# EasyEDA Pro project ProProject_5加1个按键模块-开源_2023-12-06.epro

# Schematic schematic2
Create Date: 2022-10-30; Page Name: P1; Project Name: 5个按键B; Schematic Name: Schematic2; Company: 嘉立创EDA; Page Size: A4; Version: V1.0
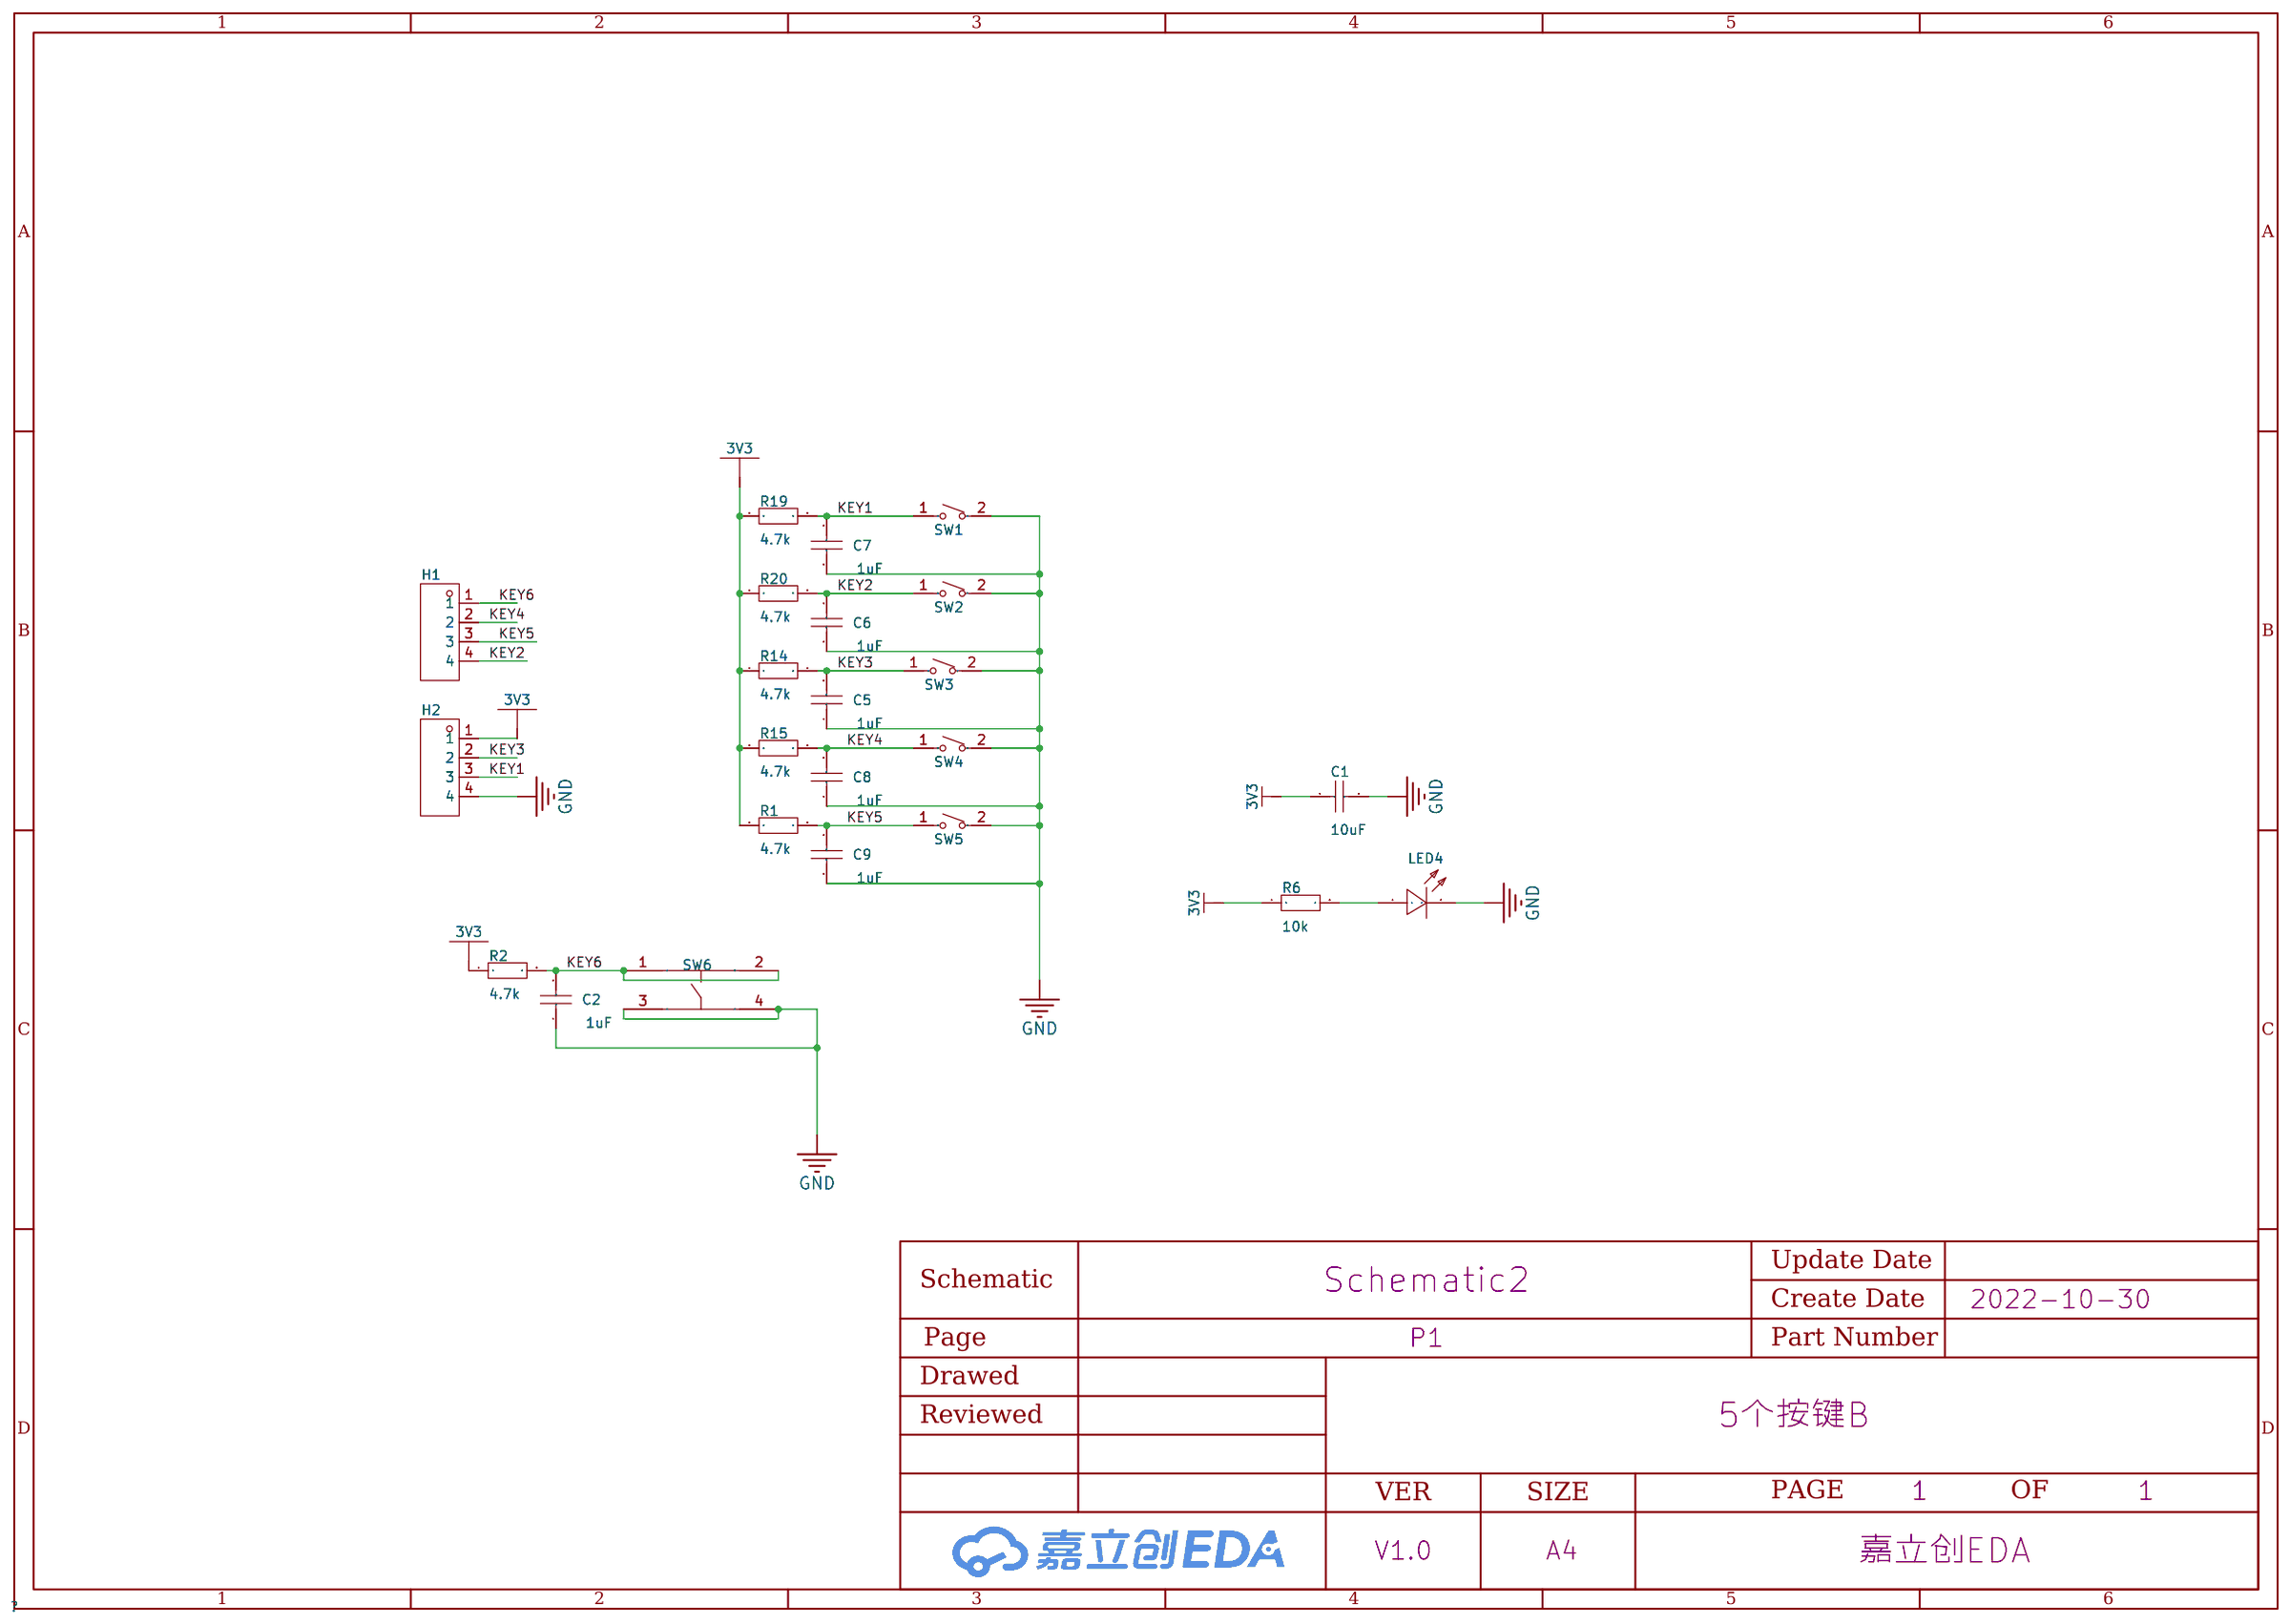
[diagram p0: schematic sheet]

## Parts
C1  10uF  [C0805]
C2  1uF  [C0603]
C5  1uF  [C0603]
C6  1uF  [C0603]
C7  1uF  [C0603]
C8  1uF  [C0603]
C9  1uF  [C0603]
H1  -  [HDR-TH_4P-P2.54-V-F]
H2  -  [HDR-TH_4P-P2.54-V-F]
LED4  KT-0603R  [LED0603-R-RD]
R1  4.7k  [R0603_3]
R2  4.7k  [R0603_3]
R6  10k  [R0603]
R14  4.7k  [R0603_3]
R15  4.7k  [R0603_3]
R19  4.7k  [R0603_3]
R20  4.7k  [R0603_3]
SW1  GT-TC141A-H050-L1  [SW-TH_L6.0-W6.0-P5.00]
SW2  GT-TC141A-H050-L1  [SW-TH_L6.0-W6.0-P5.00]
SW3  GT-TC141A-H050-L1  [SW-TH_L6.0-W6.0-P5.00]
SW4  GT-TC141A-H050-L1  [SW-TH_L6.0-W6.0-P5.00]
SW5  GT-TC141A-H050-L1  [SW-TH_L6.0-W6.0-P5.00]
SW6  PTS810SJM250SMTRLFS  [KEY-SMD_4P-L4.2-W3.2-P2.20-LS4.6]

## Library data of the parts
C1 = CL21A106KAYNNNE_C15850: 容值:10uF;精度:±10%;额定电压:25V;材质(温度系数):X5R;; LCSC Part Name: 10uF ±10% 25V; Supplier Part: C15850; Manufacturer: SAMSUNG(三星); Manufacturer Part: CL21A106KAYNNNE; Supplier Footprint: 0805; JLCPCB Part Class: 基础库; Datasheet: https://atta.szlcsc.com/upload/public/pdf/source/20160103/1457707679302.pdf; Supplier: LCSC; Tolerance: ±10%; Voltage Rated: 25V; Temperature Coefficient: X5R
C2 C5-C9 = 0603F105M160NT: 容值:1uF;精度:±20%;额定电压:16V;材质(温度系数):Y5V;; LCSC Part Name: 1uF ±20% 16V; Supplier Part: C1689; Manufacturer: FH(风华); Supplier Footprint: 0603; JLCPCB Part Class: 扩展库; Datasheet: https://atta.szlcsc.com/upload/public/pdf/source/20170923/C1689_1506149319442988473.pdf; Supplier: LCSC; Tolerance: ±20%; Voltage Rated: 16V; Temperature Coefficient: Y5V
H1 H2 = HDR-F_2.54_1x4P: Supplier Part: C2718488; Supplier Footprint: 插件
LED4 = KT-0603R: 发光颜色:红灯;二极管配置:-;透镜颜色:-;主波长:-;峰值波长:-;色温:-;光通量(25时):-;测试电流:-;正向电压(VF):-;发光强度:-;功率:-;发光角度:-;安装方式:-;工作温度:-40~+85;; LCSC Part Name: 红灯; Supplier Part: C2286; Manufacturer: KENTO; Supplier Footprint: 0603; JLCPCB Part Class: 基础库; Datasheet: https://atta.szlcsc.com/upload/public/pdf/source/20160616/1466072038404.pdf; Supplier: LCSC; Emitted Color: 红灯; Operating Temperature: -40~+85
R1 R2 R14 R15 R19 R20 = 0603WAF4701T5E: 电阻类型:厚膜电阻;阻值:4.7k;精度:±1%;功率:1/10W;温度系数:±100ppm/;最大工作电压:75V;工作温度范围:-55~+155;; LCSC Part Name: 4.7k ±1%; Supplier Part: C23162; Manufacturer: UNI-ROYAL(厚声); Supplier Footprint: 0603; Datasheet: https://atta.szlcsc.com/upload/public/pdf/source/20200306/C422600_1E6D84923E4A46A82E41ADD87F860B5C.pdf; Supplier: LCSC; Type: 厚膜电阻; Tolerance: ±1%; Power(Watts): 1/10W; Temperature Coefficient: ±100ppm/; Overload Voltage (Max): 75V; Operating Temperature Range: -55~+155; JLCPCB Part Class: Basic Part
R6 = 0603WAF1002T5E: 电阻类型:厚膜电阻;阻值:10k;精度:±1%;功率:1/10W;温度系数:±100ppm/;最大工作电压:75V;工作温度范围:-55~+155;; LCSC Part Name: 10k ±1%; Supplier Part: C25804; Manufacturer: UNI-ROYAL(厚声); Supplier Footprint: 0603; Datasheet: https://atta.szlcsc.com/upload/public/pdf/source/20200306/C422600_1E6D84923E4A46A82E41ADD87F860B5C.pdf; Supplier: LCSC; Type: 厚膜电阻; Tolerance: ±1%; Power(Watts): 1/10W; Temperature Coefficient: ±100ppm/; Overload Voltage (Max): 75V; Operating Temperature Range: -55~+155; JLCPCB Part Class: Basic Part
SW1-SW5 = GT-TC141A-H050-L1: 触点电流:50mA;额定电压(DC):12V;绝缘电阻:100MΩ;电路结构:单刀单掷;安装方式:直插;按钮形状:圆形按钮;按钮/盖帽颜色:白色;带灯:无;作用力:160gf@±30gf;机械寿命:100000;工作温度:-30℃~+85℃;引脚样式:PC引脚;开关长度:6.0mm;开关宽度:6.0mm;开关高度:5.0mm;带支架:否;; LCSC Part Name: 6x6圆形中两脚轻触开关160gf; Supplier Part: C2837071; Manufacturer: G-Switch(品赞); Supplier Footprint: 插件,6x6x5mm; JLCPCB Part Class: 扩展库; Datasheet: https://atta.szlcsc.com/upload/public/pdf/source/20210607/C2837071_E30151F7740166F304909F7305A1B181.pdf; Supplier: LCSC; Contact Current: 50mA; Voltage Rating (DC): 12V; Insulation Resistance: 100MΩ; Circuit: 单刀单掷; Mounting Style: 直插; Actuator Style: 圆形按钮; Actuator/Cap Color: 白色; With Lamp: 无; Operating Force: 160gf@±30gf; Mechanical Life: 100000; Operating Temperature: -30℃~+85℃; Pin Style: PC引脚; Switch Length: 6.0mm; Switch Width: 6.0mm; Switch Height: 5.0mm; Strike Gundam: 否
SW6 = PTS810SJM250SMTRLFS: 触点电流:50mA;额定电压(DC):16V;电路结构:单刀单掷;安装方式:立贴;按钮形状:圆形按钮;带灯:-;开关长度:4.2mm;开关宽度:3.2mm;开关高度:2.5mm;; Supplier Part: C116501; Manufacturer: C&K; Supplier Footprint: SMD; JLCPCB Part Class: 扩展库; Datasheet: https://atta.szlcsc.com/upload/public/pdf/source/20180704/C116501_199B7AD0EF93D1F69D47FA53D559C299.pdf; Supplier: LCSC; Contact Current: 50mA; Voltage Rating (DC): 16V; Circuit: 单刀单掷; Mounting Style: 立贴; Actuator Style: 圆形按钮; Switch Length: 4.2mm; Switch Width: 3.2mm; Switch Height: 2.5mm

## Nets
3V3: C1.2 H2.1 R1.1 R2.1 R6.1 R14.1 R15.1 R19.1 R20.1
GND: C1.1 C2.1 C5.1 C6.1 C7.1 C8.1 C9.1 H2.4 LED4.2(K) SW1.2 SW2.2 SW3.2 SW4.2 SW5.2 SW6.3 SW6.4
KEY1: C7.2 H2.3 R19.2 SW1.1
KEY2: C6.2 H1.4 R20.2 SW2.1
KEY3: C5.2 H2.2 R14.2 SW3.1
KEY4: C8.2 H1.2 R15.2 SW4.1
KEY5: C9.2 H1.3 R1.2 SW5.1
KEY6: C2.2 H1.1 R2.2 SW6.1 SW6.2
$1N3344: LED4.1(A) R6.2

# Board PCB2
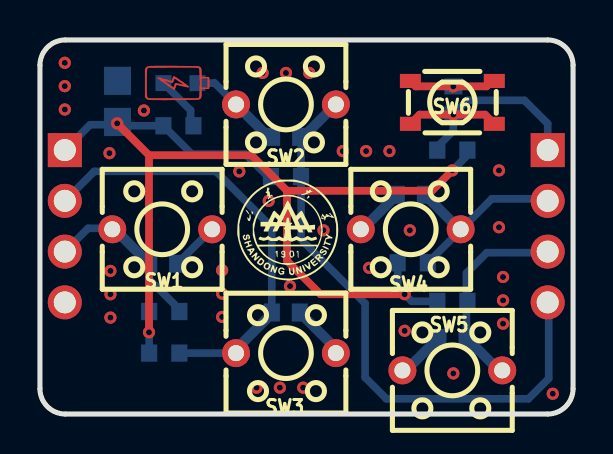
[diagram p1: board, top side]
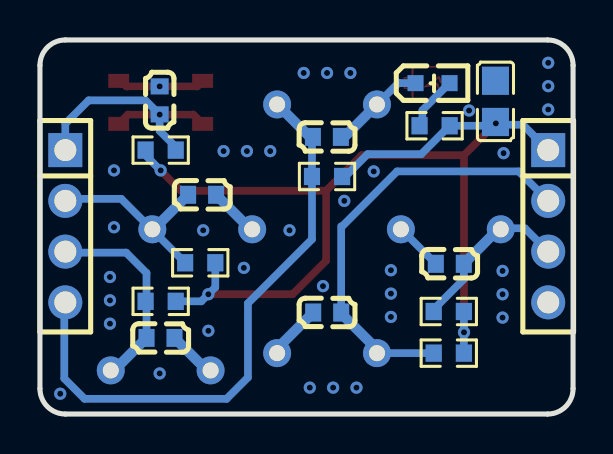
[diagram p2: board, bottom side, seen from below]

Outline 26.7 x 18.72 mm; copper layers: Top Layer, Bottom Layer. Coordinates in mm from the lower left corner of the outline.
Outline path: 0,17.45 0,1.27 arc(0.37,0.37) 1.27,0 25.43,0 arc(26.32,0.37) 26.7,1.27 26.7,17.45 arc(26.32,18.35) 25.43,18.72 1.27,18.72 arc(0.37,18.35) 0,17.45
Stack: Top Layer 0.035mm / Dielectric1 1.51mm FR4 er 4.5 / Bottom Layer 0.035mm

## Design rules (mm)
spacing safeClearance (default): track to track 0.152, other pairs 0.152 to 0.3
track width trackWidth (default): min 0.127, default 0.254, max 2.54
differential pair differentialPair (default): width min 0.127, default 0.254, max 2.54; gap min 0.152, default 0.152
via viaSize (default): diameter min 0.5, default 0.61, max 10; hole min 0.3, default 0.305, max 6

## Placement (name value [footprint] x y rotation side)
C1  10uF  [C0805]  3.89 15.65 270 bottom
C2  1uF  [C0603]  20.7 15.7 270 bottom
C5  1uF  [C0603]  12.31 5.08 180 bottom
C6  1uF  [C0603]  12.33 13.87 0 bottom
C7  1uF  [C0603]  6.17 7.52 180 bottom
C8  1uF  [C0603]  18.57 10.97 0 bottom
C9  1uF  [C0603]  20.66 3.81 0 bottom
H1  -  [HDR-TH_4P-P2.54-V-F]  25.43 9.4 270 bottom
H2  -  [HDR-TH_4P-P2.54-V-F]  1.24 9.4 270 bottom
LED4  KT-0603R  [LED0603-R-RD]  7.04 16.56 180 bottom
R1  4.7k  [R0603_3]  20.65 5.64 0 bottom
R2  4.7k  [R0603_3]  20.65 13.21 180 bottom
R6  10k  [R0603]  6.93 14.43 0 bottom
R14  4.7k  [R0603_3]  6.22 3.05 0 bottom
R15  4.7k  [R0603_3]  18.67 7.57 0 bottom
R19  4.7k  [R0603_3]  6.22 5.13 0 bottom
R20  4.7k  [R0603_3]  12.32 11.89 0 bottom
SW1  GT-TC141A-H050-L1  [SW-TH_L6.0-W6.0-P5.00]  6.12 9.25 0 top
SW2  GT-TC141A-H050-L1  [SW-TH_L6.0-W6.0-P5.00]  12.32 15.49 180 top
SW3  GT-TC141A-H050-L1  [SW-TH_L6.0-W6.0-P5.00]  12.32 3.05 0 top
SW4  GT-TC141A-H050-L1  [SW-TH_L6.0-W6.0-P5.00]  18.57 9.25 180 top
SW5  GT-TC141A-H050-L1  [SW-TH_L6.0-W6.0-P5.00]  20.65 2.18 180 top
SW6  PTS810SJM250SMTRLFS  [KEY-SMD_4P-L4.2-W3.2-P2.20-LS4.6]  20.65 15.6 180 top

## Footprints (pads in the part's own frame, mm; a bottom-side part is the same pattern mirrored in y, then rotated)
C0603
  rect 0.8x0.9 smd: 1(-0.7,0) 2(0.7,0)
C0805
  rect 1.41x1.35 smd: 1(-1.03,0) 2(1.03,0)
HDR-TH_4P-P2.54-V-F
  rect 1.7x1.7 hole 1.1: 1(-3.81,0)
  round 1.7 hole 1.1: 2(-1.27,0) 3(1.27,0) 4(3.81,0)
KEY-SMD_4P-L4.2-W3.2-P2.20-LS4.6
  rect 1.049x0.701 smd: 1(-2.1,1.075) 2(2.1,1.075) 3(-2.1,-1.075) 4(2.1,-1.075)
LED0603-R-RD
  rect 0.8x0.8 smd: 1(0.851,0) 2(-0.851,0)
R0603
  rect 0.807x0.864 smd: 1(-0.754,0) 2(0.754,0)
R0603_3
  rect 0.807x0.864 smd: 1(-0.754,0) 2(0.754,0)
SW-TH_L6.0-W6.0-P5.00
  round 1.4 hole 0.8: 1(-2.5,0) 2(2.5,0)

## Nets
As in the schematic.

## Via types
v1: diameter 0.61, hole 0.305, Top Layer to Bottom Layer, 40 vias

## Routing (per net, layer and track width the routed paths; a pad name or vN(x,y) marks a point on that pad's centre or on a via; arc(x,y) is an arc through that point)
3V3: length 56.7
  Top Layer w0.381: v1(18.26,5.99) 14.05,5.99 12.37,7.67 12.37,11.18 ; 5.46,12.95 v1(5.46,4.09) ; 5.46,12.95 v1(3.87,14.55) ; 5.46,12.95 10.59,12.95 12.37,11.18 ; v1(20.65,12.19) 19.63,11.18 12.37,11.18
  Bottom Layer w0.381: 3.58,14.43 3.63,14.43 ; 3.63,14.43 6.18,14.43 7.6,13 10.29,13 11.56,11.73 ; 3.63,14.43 3.58,14.48 2.51,14.48 H2.1 ; R19.1 5.47,3.11 5.46,3.1 ; 21.46,13.41 21.46,13 v1(20.65,12.19) ; R15.1 17.91,6.34 v1(18.26,5.99) 18.62,5.64 19.94,5.64
GND: length 19.5
  Top Layer w0.381: SW6.4 18.82,16.4 v1(20.7,16.4) 22.37,16.4 22.68,16.71
  Bottom Layer w0.381: C7.1 8.56,9.21 8.56,9.3 ; 8.73,16.58 SW2.2 ; LED4.2 8.71,16.56
  Bottom Layer w0.508: 14.86,3.05 14.86,3.23 C5.1 ; 18.21,2.29 18.43,2.29 C9.1 ; C8.1 16.15,9.25 15.93,9.25 ; SW2.2 11.44,13.87 11.61,13.87
  vias: v1(1.24,17.58) v1(1.24,16.41) v1(1.24,15.24) v1(3.48,13.06) v1(3.53,7.16) v1(3.53,5.99) v1(3.53,4.83) v1(5.21,15.19) v1(9.12,7.2) v1(9.12,6.03) v1(9.12,4.86) v1(9.98,12.14) v1(10.85,1.32) v1(11.15,17.07) v1(11.46,10.67) v1(12.01,1.32) v1(12.32,17.07) v1(12.52,6.4) v1(13.18,1.32) v1(13.49,17.07) v1(14.2,9.19) v1(15.16,13.16) v1(16.33,13.16) v1(16.48,7.32) v1(17.5,13.16) v1(18.26,4.17) v1(18.52,9.19) v1(20.7,2.03) v1(22.99,12.19) v1(22.99,9.35) v1(23.19,6.86) v1(23.19,5.69) v1(23.19,4.52) v1(25.68,1.02)
KEY1: length 8.3
  Bottom Layer w0.381: C7.2 5.47,6.75 6.88,5.33 ; H2.3 2.41,9.3 3.63,9.3
  Bottom Layer w0.508: 3.73,8.99 3.73,9.24 3.75,9.24 C7.2
KEY2: length 29.7
  Bottom Layer w0.381: 13.03,13.87 13.07,13.83 R20.2 13.07,8.75 16.28,5.54 16.28,1.83 17.35,0.76 24.46,0.76 25.48,1.78 25.48,5.18 25.17,5.49
  Bottom Layer w0.508: 14.76,15.44 13.18,13.87 C6.2
KEY3: length 22
  Bottom Layer w0.381: H2.2 2.72,12.14 8.81,12.14 11.56,9.4 ; 11.61,9.4 C5.2 ; R14.2 9.47,3.05 ; 9.63,3.05 9.73,3.05
  Bottom Layer w0.508: 9.52,2.95 11.61,5.03 C5.2
KEY4: length 9.6
  Bottom Layer w0.381: R15.2 22.62,10.77 25.27,10.77
  Bottom Layer w0.508: 21.01,9.25 21,9.25 C8.2
KEY5: length 10.2
  Bottom Layer w0.381: 25.43,8.18 25.32,8.08 22.38,8.08 21.36,7.06 C9.2
  Bottom Layer w0.508: 23.09,2.08 23.08,2.08 C9.2
KEY6: length 13.4
  Top Layer w0.381: SW6.1 22.29,14.99 v1(20.7,14.99) 19.01,14.99 SW6.2
  Bottom Layer w0.381: v1(20.7,14.99) 20.7,14.17 19.94,13.41 ; v1(20.7,14.99) 21.41,15.7 24.26,15.7 25.43,14.53 H1.1 ; v1(20.7,14.99) 20.6,14.88
$1N3344: length 2.8
  Bottom Layer w0.381: 7.54,14.33 7.54,15.2 LED4.1

## Copper pours and planes (outline as drawn; the poured copper is in the pictures)
GND on Top Layer: -1.75,21.74 26.95,21.74 26.95,-3.45 -1.75,-3.45
GND on Bottom Layer: -0.28,24.08 28.52,24.08 28.52,-3.25 -0.28,-3.25

Small or netless copper shapes (teardrops, artwork), in the pictures only: 2 on Top Layer
